# Altium schematic sheet Sheet1.SchDoc
size A4; SheetNumber: 1; SheetTotal: 2
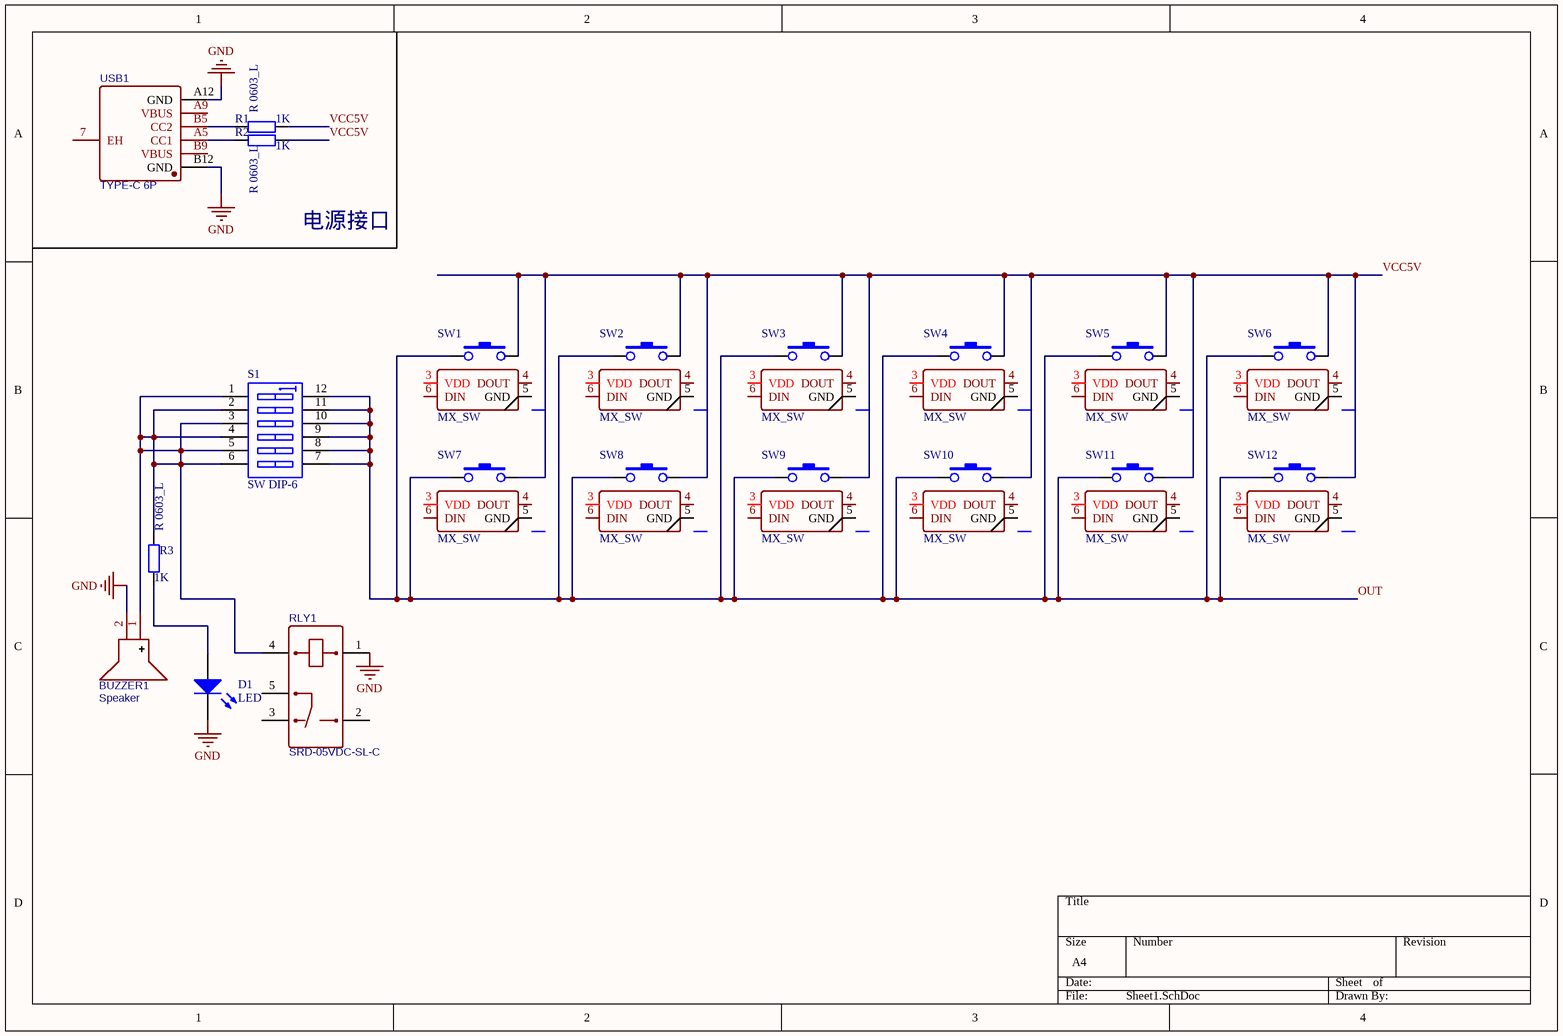
[diagram p0: Sheet1.SchDoc]

## Parts
BUZZER1  Speaker  [Speaker]
D1  LED  [LED 0805R]
R1  R 0603_L  value 1K  [R 0603_L]
R2  R 0603_L  value 1K  [R 0603_L]
R3  R 0603_L  value 1K  [R 0603_L]
RLY1  SRD-05VDC-SL-C  [SRD-05VDC-SL-C]
S1  SW DIP-6  [DIP-12/SW]
SW1  MX_SW  [MX_SW-1]
SW2  MX_SW  [MX_SW-1]
SW3  MX_SW  [MX_SW-1]
SW4  MX_SW  [MX_SW-1]
SW5  MX_SW  [MX_SW-1]
SW6  MX_SW  [MX_SW-1]
SW7  MX_SW  [MX_SW-1]
SW8  MX_SW  [MX_SW-1]
SW9  MX_SW  [MX_SW-1]
SW10  MX_SW  [MX_SW-1]
SW11  MX_SW  [MX_SW-1]
SW12  MX_SW  [MX_SW-1]
USB1  TYPE-C 6P  [TYPE-C-SMD_TYPE-C-6P]

## Nets
GND: BUZZER1.2(-) D1.2(K) RLY1.1 USB1.A12(GND) USB1.B12(GND)
OUT: S1.7(B6) S1.8(B5) S1.9(B4) S1.10(B3) S1.11(B2) S1.12(B1) SW1.1 SW2.1 SW3.1 SW4.1 SW5.1 SW6.1 SW7.1 SW8.1 SW9.1 SW10.1 SW11.1 SW12.1
VCC5V: R1.2 R2.2 SW1.2 SW2.2 SW3.2 SW4.2 SW5.2 SW6.2 SW7.2 SW8.2 SW9.2 SW10.2 SW11.2 SW12.2
NetBUZZER1_1: BUZZER1.1(+) R3.1 RLY1.4 S1.1(A1) S1.2(A2) S1.3(A3) S1.4(A4) S1.5(A5) S1.6(A6)
NetD1_1: D1.1(A) R3.2
NetR1_1: R1.1 USB1.B5(CC2)
NetR2_1: R2.1 USB1.A5(CC1)

Not connected (* = marked no-connect by the designer): RLY1 2 3 5; SW1 3(VDD) 4(DOUT) 5(GND) 6(DIN); SW2 3(VDD) 4(DOUT) 5(GND) 6(DIN); SW3 3(VDD) 4(DOUT) 5(GND) 6(DIN); SW4 3(VDD) 4(DOUT) 5(GND) 6(DIN); SW5 3(VDD) 4(DOUT) 5(GND) 6(DIN); SW6 3(VDD) 4(DOUT) 5(GND) 6(DIN); SW7 3(VDD) 4(DOUT) 5(GND) 6(DIN); SW8 3(VDD) 4(DOUT) 5(GND) 6(DIN); SW9 3(VDD) 4(DOUT) 5(GND) 6(DIN); SW10 3(VDD) 4(DOUT) 5(GND) 6(DIN); SW11 3(VDD) 4(DOUT) 5(GND) 6(DIN); SW12 3(VDD) 4(DOUT) 5(GND) 6(DIN); USB1 7(EH) A9(VBUS) B9(VBUS)

## Notes on the sheet
- 电源接口

## Library data of the parts
BUZZER1 = Speaker: BOM_Manufacturer: FUET; BOM_Manufacturer Part: FMB1275-05; Contributor: LCSC; Frequency: 2300Hz; BOM_Supplier: LCSC; BOM_Supplier Part: C482357; BOM_JLCPCB Part Class: Extended Part; spicePre: B; spiceSymbolName: FMB1275-05
D1 = LED 0805R 红: Typical INFRARED GaAs LED; Published: 8-Jun-2000; LatestRevisionDate: 08-Jul-2005; LatestRevisionNote: Mech Layer 1 removed.; PackageReference: LED-0; Publisher: Altium Limited; PackageDescription: LED; 2 Leads
R1-R3 = R 0603_L: Resistor; Published: 8-Jun-2000; LatestRevisionDate: 17-Jul-2002; LatestRevisionNote: Re-released for DXP Platform.; PackageReference: AXIAL-0.4; Publisher: Altium Limited; PackageDescription: Axial Device, Thru-Hole; 2 Leads; 0.4 in Pin Spacing
RLY1 = SRD-05VDC-SL-C: BOM_Manufacturer: SONGLE; BOM_Supplier: LCSC; BOM_Manufacturer Part: SRD-05VDC-SL-C; BOM_Supplier Part: C35449; BOM_JLCPCB Part Class: Extended Part; spicePre: R; spiceSymbolName: SRD-05VDC-SL-C
S1 = SW DIP-6: DIP Switch, 6 Position, SPST; Published: 24-Mar-1999; LatestRevisionDate: 17-Jul-2002; LatestRevisionNote: Re-released for DXP Platform.; PackageReference: DIP-12/SW; Publisher: Altium Limited; PackageDescription: DIP Switch; 12 Leads
SW1-SW12 = MX_SW-1
USB1 = TYPE-C 6P: BOM_Manufacturer: SHOU HAN; Contributor: LCSC; BOM_Supplier: LCSC; BOM_Supplier Part: C456012; BOM_Manufacturer Part: TYPE-C 6P; BOM_JLCPCB Part Class: Extended Part; spicePre: U; spiceSymbolName: TYPE-C 6P